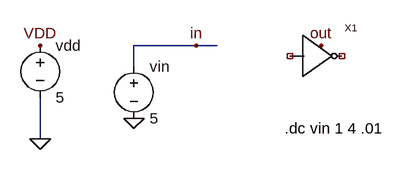
[diagram p0: schematic inverter_test1.asc]
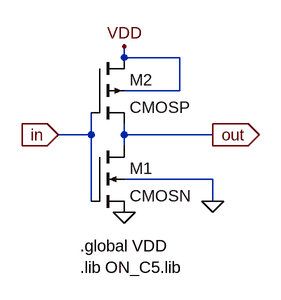
[diagram p1: sub-circuit inverter.asc]
inverter_test1.asc, the LTspice schematic file:
Version 4
SHEET 1 880 680
WIRE 240 96 144 96
WIRE 272 96 240 96
WIRE 144 128 144 96
WIRE 0 240 0 176
FLAG 0 96 VDD
FLAG 0 240 0
FLAG 144 208 0
FLAG 240 96 in
FLAG 432 96 out
SYMBOL voltage 0 80 R0
WINDOW 123 0 0 Left 2
WINDOW 39 0 0 Left 2
SYMATTR InstName vdd
SYMATTR Value 5
SYMBOL voltage 144 112 R0
WINDOW 123 0 0 Left 2
WINDOW 39 0 0 Left 2
SYMATTR InstName vin
SYMATTR Value 5
SYMBOL inverter 416 112 R0
SYMATTR InstName X1
TEXT 376 224 Left 2 !.dc vin 1 4 .01

inverter.asc, the sub-circuit schematic file:
Version 4
SHEET 1 900 680
WIRE 160 112 160 96
WIRE 240 112 160 112
WIRE 240 160 240 112
WIRE 240 160 160 160
WIRE 112 224 112 192
WIRE 112 224 64 224
WIRE 160 224 160 208
WIRE 288 224 160 224
WIRE 160 240 160 224
WIRE 288 288 160 288
WIRE 112 320 112 224
WIRE 288 320 288 288
FLAG 288 224 out
IOPIN 288 224 Out
FLAG 64 224 in
IOPIN 64 224 In
FLAG 160 336 0
FLAG 288 320 0
FLAG 160 96 VDD
SYMBOL nmos4 112 240 R0
SYMATTR InstName M1
SYMATTR Value CMOSN
SYMATTR Value2 l=0.6u w=0.9u
SYMBOL pmos4 112 112 R0
SYMATTR InstName M2
SYMATTR Value CMOSP
SYMATTR Value2 l=0.6u w=1.8u
TEXT 96 384 Left 2 !.global VDD\n.lib ON_C5.lib

The netlist it stands for:
* inverter_test1.asc
vdd VDD 0 5
vin in 0 5
XX1 NC_01 NC_02 inverter

* block symbol definitions
.subckt inverter in out
M1 out in 0 0 CMOSN l=0.6u w=0.9u
M2 VDD in out VDD CMOSP l=0.6u w=1.8u
.global VDD
.lib ON_C5.lib
.ends inverter

.model NMOS NMOS
.model PMOS PMOS
.lib standard.mos
.dc vin 1 4 .01
.backanno
.end